# Altium schematic sheet PP_2_0_4.SchDoc
size 209 x 297 mm; PageSetup: Record=PageOptions|CenterHorizontal=True|CenterVertical=True|PrintScale=0.94|XCorrection=1.00|YCorrection=1.00|PrintKind=2|BorderSize=5000000|LeftOffset=0|BottomOffset=0|Orientation=1|PaperLength=2970|PaperWidth=2100|Scale=100|PaperSource=7|PrintQuality=600|MediaType=1|DitherType=10|PaperKind=A4|PrintScaleMode=1; Title1str: (вторая строка при необходимости); DocumentType: Тип схемы; DocumentNumber: 53251498.468331.01.04.00 Э3; SheetNumber: 5; Format: A4
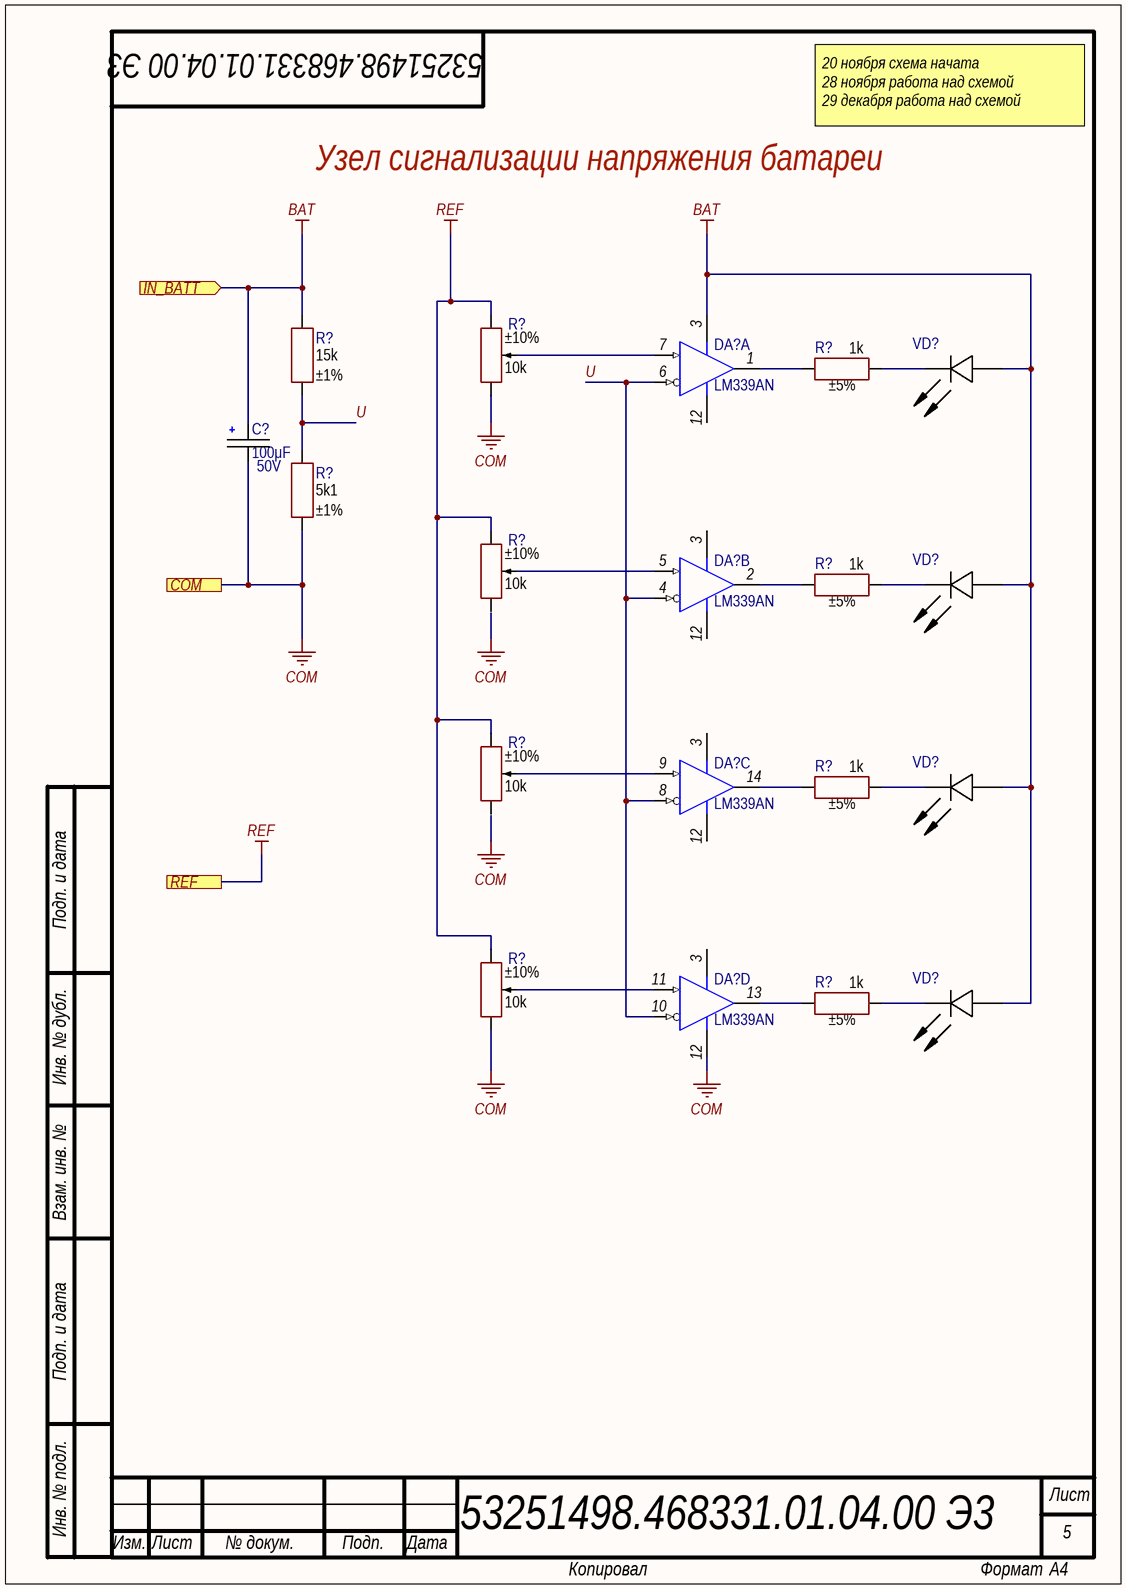
[diagram p0: PP_2_0_4.SchDoc]

## Parts
(Parts that share a designator on the sheet are numbered #1, #2 ... from top to bottom, then left to right.)
C?  value 100μF  Voltage: 50V  [CAP: RB2-5]  (hidden comment: Cap Pol1)
DA?#1  LM339AN  [N014]  (part A of 4)
DA?#2  LM339AN  [N014]  (part B of 4)
DA?#3  LM339AN  [N014]  (part C of 4)
DA?#4  LM339AN  [N014]  (part D of 4)
R?#1  value 10k  Tolerance: ±10%  [RES: 3296W]
R?#2  value 1k  Tolerance: ±5%  [RES:CF-1/4W]
R?#3  value 15k  Tolerance: ±1%  [RES:CF-1/4W]
R?#4  value 5k1  Tolerance: ±1%  [RES:CF-1/4W]
R?#5  value 10k  Tolerance: ±10%  [RES: 3296W]
R?#6  value 1k  Tolerance: ±5%  [RES:CF-1/4W]
R?#7  value 10k  Tolerance: ±10%  [RES: 3296W]
R?#8  value 1k  Tolerance: ±5%  [RES:CF-1/4W]
R?#9  value 10k  Tolerance: ±10%  [RES: 3296W]
R?#10  value 1k  Tolerance: ±5%  [RES:CF-1/4W]
VD?#1  (no value)  [LED: 3MM_301_G]
VD?#2  (no value)  [LED: 3MM_301_G]
VD?#3  (no value)  [LED: 3MM_301_G]
VD?#4  (no value)  [LED: 3MM_301_G]

## Ports
COM, IN_BATT (in), REF

## Nets
BAT: C?.2 DA?#1.3(VCC) R?#3.2 VD?#1.1(A) VD?#2.1(A) VD?#3.1(A) VD?#4.1(A) ; port IN_BATT
COM: C?.1 DA?#4.12(GND) R?#1.3 R?#4.1 R?#9.3 ; port COM
REF: R?#1.1 R?#5.1 R?#7.1 R?#9.1 ; port REF
U: DA?#1.6(IN-) DA?#2.4(IN-) DA?#3.8(IN-) DA?#4.10(IN-) R?#3.1 R?#4.2
NetDA?#1_1: DA?#1.1(OUT) R?#2.1
NetDA?#1_7: DA?#1.7(IN+) R?#1.2
NetDA?#2_2: DA?#2.2(OUT) R?#6.1
NetDA?#2_5: DA?#2.5(IN+) R?#5.2
NetDA?#3_9: DA?#3.9(IN+) R?#7.2
NetDA?#3_14: DA?#3.14(OUT) R?#8.1
NetDA?#4_11: DA?#4.11(IN+) R?#9.2
NetDA?#4_13: DA?#4.13(OUT) R?#10.1
NetR?#2_2: R?#2.2 VD?#1.2(C)
NetR?#6_2: R?#6.2 VD?#2.2(C)
NetR?#8_2: R?#8.2 VD?#3.2(C)
NetR?#10_2: R?#10.2 VD?#4.2(C)

Not connected (* = marked no-connect by the designer): DA?#1 12(GND); DA?#2 3(VCC) 12(GND); DA?#3 3(VCC) 12(GND); DA?#4 3(VCC); R?#5 3; R?#7 3

## Notes on the sheet
- 20 ноября схема начата
  28 ноября работа над схемой
  29 декабря работа над схемой
- Узел сигнализации напряжения батареи
- Подп. и дата
- Инв. № дубл.
- Взам. инв. №
- Инв. № подл.
- Лист
- Изм.
- № докум.
- Подп.
- Дата
- Копировал
- Формат

## Library data of the parts
C? = Cap Pol1: Polarized Capacitor (Radial); Partnumber: JRB1E101M02500630110000B; Pitch: 2.5mm; Published: 8-Jun-2000; LatestRevisionDate: 17-Jul-2002; LatestRevisionNote: Re-released for DXP Platform.; PackageReference: RB2-5; Publisher: Altium Limited; PackageDescription: Polarized Capacitor (Radial); 2 Leads
DA?#1-DA?#4 = LM339AN: Quad Differential Comparator; Published: 15-Apr-2002; LatestRevisionDate: 04-Mar-2005; LatestRevisionNote: Stylized 3D Model Added.; DatasheetVersion: Apr-1988; PackageVersion: Oct-1995; PackageReference: N014; Publisher: Altium Limited; PackageDescription: DIP; 14 Leads; Row Spacing 7.62 mm; Pitch 2.54 mm; ComponentLink1Description: Manufacturer Link; ComponentLink1URL: http://www.ti.com/; ComponentLink2Description: Datasheet; ComponentLink2URL: http://www-s.ti.com/sc/ds/lm139a.pdf
R?#1 R?#5 R?#7 R?#9 = Trimmer: Manufacturer: Bourns; PartNumber: 3296W-1-103LF; ValueManufacturerPartNumber: Resistor film, 10k, ±10%, 3296W, 0.5W, -55...+125°C; TypeResistor: Resistor film; Power: 0.5W; Package: 3296W; HelpURL: https://www.digikey.com/product-detail/en/bourns-inc/3296W-1-103LF/3296W-103LF-ND/1088045; Temperature: -55...+125°C
R?#2 R?#6 R?#8 R?#10 = Resistor_CF-25: Manufacturer: Yageo; PartNumber: CF-1/4W-1KJ; ValueManufacturerPartNumber: Resistor film, 1k, ±5%, CF-25, 0.25W, -55...+125°C; TypeResistor: Resistor film; Power: 0.25W; Package: CF-25; HelpURL: https://www.chipdip.ru/product0/44435; Temperature: -55...+125°C
R?#3 = Resistor_CF-25: MF-25 (С2-23) 0.25 Вт, 15 кОм, 1%, Резистор металлопленочный; Manufacturer: Yageo; PartNumber: MF-1/4W-15KF; ValueManufacturerPartNumber: Resistor film, 15k, ±1%, MF-25, 0.25W, -55...+125°C; TypeResistor: Resistor film; Power: 0.25W; Package: MF-25; HelpURL: https://www.digikey.com/product-detail/en/yageo/RC0201JR-07100RL/311-100NCT-ND/1949006; Temperature: -55...+125°C
R?#4 = Resistor_CF-25: MF-25 (С2-23) 0.25 Вт, 5.1 кОм, 1%, Резистор металлопленочный; Manufacturer: Yageo; PartNumber: MF-1/4W-5K1F; ValueManufacturerPartNumber: Resistor film, 5k1, ±1%, MF-25, 0.25W, -55...+125°C; TypeResistor: Resistor film; Power: 0.25W; Package: MF-25; HelpURL: https://www.chipdip.ru/product0/29916; Temperature: -55...+125°C
VD?#1-VD?#4 = LED_single: ValueManufacturerPartNumber: LED, Green, *, *, *, -55...+150°C; TypeDiode: LED; ColorParameter: Green; Manufacturer: *; Package: *; HelpURL: *; Temperature: -55...+150°C; Current: *; VoltageDrop: *; PartNumber: *; Color: GREEN